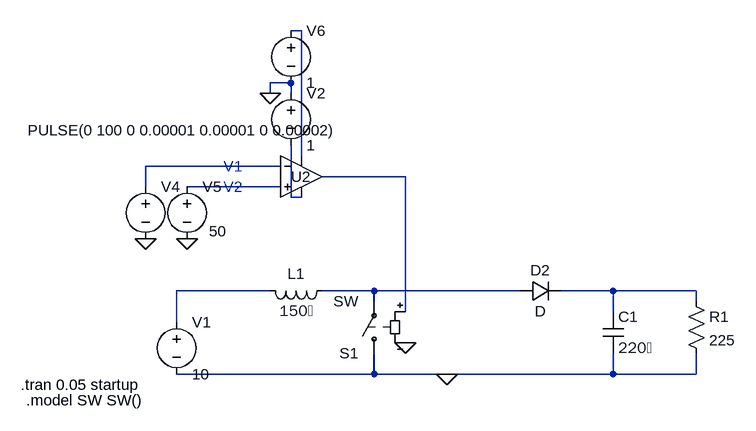
[diagram p0: schematic Buckconverter.asc]
Buckconverter.asc, the LTspice schematic file:
Version 4
SHEET 1 1428 680
WIRE -64 -304 -80 -304
WIRE -80 -224 -112 -224
WIRE -112 -208 -112 -224
WIRE -80 -208 -80 -224
WIRE -64 -112 -64 -304
WIRE -96 -96 -304 -96
WIRE 96 -80 -32 -80
WIRE -304 -64 -304 -96
WIRE -96 -64 -240 -64
WIRE -80 -48 -80 -128
WIRE -64 -48 -80 -48
WIRE -112 96 -256 96
WIRE 48 96 -32 96
WIRE 272 96 48 96
WIRE 416 96 336 96
WIRE 544 96 416 96
WIRE 48 112 48 96
WIRE 544 112 544 96
WIRE 96 128 96 -80
WIRE 416 128 416 96
WIRE -256 144 -256 96
WIRE 48 224 48 192
WIRE 48 224 -256 224
WIRE 160 224 48 224
WIRE 416 224 416 192
WIRE 416 224 160 224
WIRE 544 224 544 192
WIRE 544 224 416 224
FLAG -304 16 0
FLAG -240 16 0
FLAG 96 176 0
FLAG -112 -208 0
FLAG 160 224 0
SYMBOL voltage -256 128 R0
WINDOW 123 0 0 Left 2
WINDOW 39 0 0 Left 2
SYMATTR InstName V1
SYMATTR Value 10
SYMBOL res 528 96 R0
SYMATTR InstName R1
SYMATTR Value 225
SYMBOL cap 400 128 R0
SYMATTR InstName C1
SYMATTR Value 220�
SYMBOL sw 48 208 R180
SYMATTR InstName S1
SYMBOL Opamps\\UniversalOpamp2 -64 -80 R0
WINDOW 0 -16 0 Left 2
SYMATTR InstName U2
SYMBOL voltage -304 -80 R0
WINDOW 3 -181 -71 Left 2
WINDOW 123 0 0 Left 2
WINDOW 39 0 0 Left 2
SYMATTR Value PULSE(0 100 0 0.00001 0.00001 0 0.00002)
SYMATTR InstName V4
SYMBOL voltage -240 -80 R0
WINDOW 123 0 0 Left 2
WINDOW 39 0 0 Left 2
WINDOW 3 34 84 Left 2
SYMATTR Value 50
SYMATTR InstName V5
SYMBOL voltage -80 -320 R0
WINDOW 123 0 0 Left 2
WINDOW 39 0 0 Left 2
SYMATTR InstName V6
SYMATTR Value 1
SYMBOL voltage -80 -224 R0
WINDOW 123 0 0 Left 2
WINDOW 39 0 0 Left 2
SYMATTR InstName V2
SYMATTR Value 1
SYMBOL diode 272 112 R270
WINDOW 0 32 32 VTop 2
WINDOW 3 0 32 VBottom 2
SYMATTR InstName D2
SYMBOL ind -16 80 R90
WINDOW 0 5 56 VBottom 2
WINDOW 3 32 56 VTop 2
SYMATTR InstName L1
SYMATTR Value 150�
TEXT -184 -96 Left 2 ;V1
TEXT -184 -64 Left 2 ;V2
TEXT -496 240 Left 2 !.tran 0.05 startup
TEXT -488 264 Left 2 !.model SW SW()

The netlist it stands for:
* Buckconverter.asc
V1 N006 0 10
R1 N008 0 225
C1 N008 0 220�
S1 0 N007 N003 0 SW
XU2 N004 N002 N001 N005 N003 level.2 Avol=1Meg GBW=10Meg Slew=10Meg ilimit=25m rail=0 Vos=0 phimargin=45 en=0 enk=0 in=0 ink=0 Rin=500Meg  ; pins IN+ IN- V+ V- OUT
V4 N002 0 PULSE(0 100 0 0.00001 0.00001 0 0.00002)
V5 N004 0 50
V6 N001 0 1
V2 0 N005 1
D2 N007 N008 D
L1 N007 N006 150�
.model D D
.lib standard.dio
* V1
* V2
.tran 0.05 startup
.model SW SW()
.lib UniversalOpamps2.sub
.backanno
.end